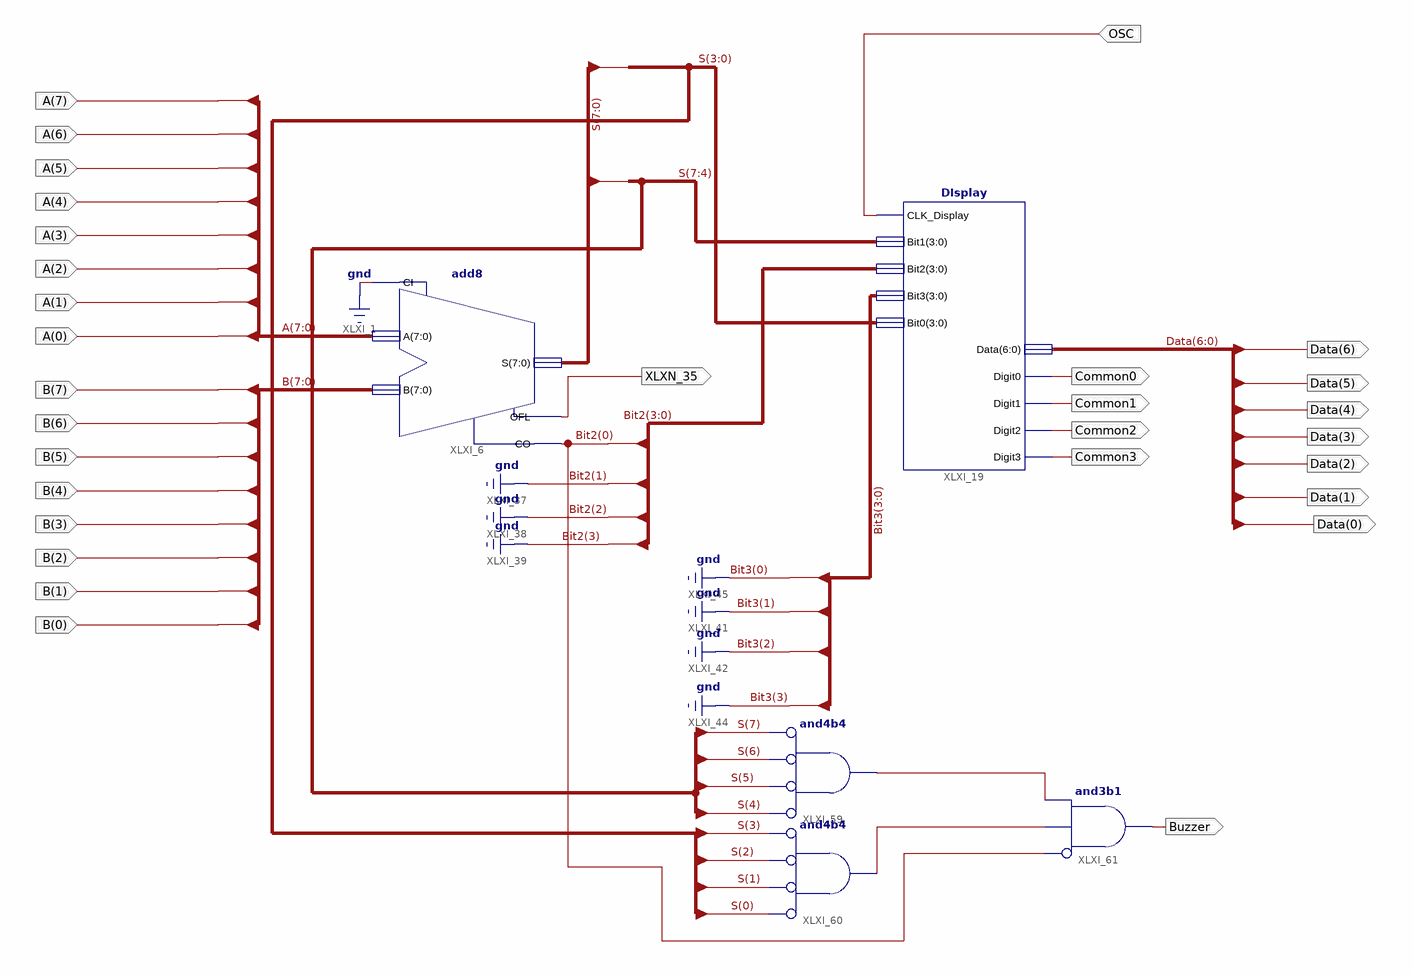
[diagram p0: schematic sheet 1]
// Xilinx ISE schematic Lab8.sch (spartan6) as structural Verilog: 5 symbols, 30 ports
module Lab8 (
  input  [7:0] A,
  input  [7:0] B,
  input  OSC,
  output XLXN_35,
  output [6:0] Data,
  output Common0,
  output Common1,
  output Common2,
  output Common3,
  output Buzzer
);

  wire XLXN_133, XLXN_134;
  wire [0:0] Bit2;
  wire [7:0] S;

  add8 XLXI_6 (.A(A), .B(B), .CI(1'b0), .CO(Bit2[0]), .OFL(XLXN_35), .S(S));
  DIsplay XLXI_19 (
    .CLK_Display(OSC), .Bit1(S[7:4]), .Bit2({3'b000, Bit2[0]}), .Bit3(4'b0000), .Bit0(S[3:0]), .Data(Data),
    .Digit0(Common0), .Digit1(Common1), .Digit2(Common2), .Digit3(Common3));
  and XLXI_59 (XLXN_133, ~S[4], ~S[5], ~S[6], ~S[7]);  // and4b4
  and XLXI_60 (XLXN_134, ~S[0], ~S[1], ~S[2], ~S[3]);  // and4b4
  and XLXI_61 (Buzzer, ~Bit2[0], XLXN_134, XLXN_133);  // and3b1
endmodule
